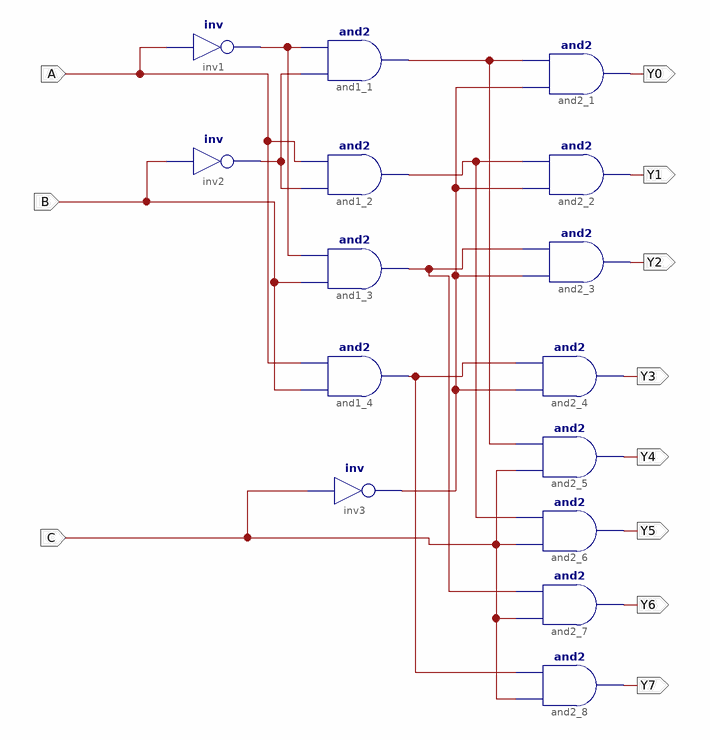
[diagram p0: schematic sheet 1]
// Xilinx ISE schematic decpder38_sch.sch (spartan3) as structural Verilog: 15 symbols, 11 ports
module decpder38_sch (
  input  A,
  input  B,
  input  C,
  output Y1,
  output Y2,
  output Y3,
  output Y4,
  output Y5,
  output Y6,
  output Y7,
  output Y0
);

  wire XLXN_4, XLXN_14, XLXN_16, XLXN_17, XLXN_22, XLXN_23, XLXN_33;

  and and1_1 (XLXN_33, XLXN_16, XLXN_14);
  and and1_2 (XLXN_22, XLXN_16, A);
  and and1_3 (XLXN_4, B, XLXN_14);
  and and1_4 (XLXN_23, B, A);
  and and2_1 (Y0, XLXN_17, XLXN_33);
  and and2_2 (Y1, XLXN_17, XLXN_22);
  and and2_3 (Y2, XLXN_17, XLXN_4);
  and and2_4 (Y3, XLXN_17, XLXN_23);
  and and2_5 (Y4, C, XLXN_33);
  and and2_6 (Y5, C, XLXN_22);
  and and2_7 (Y6, C, XLXN_4);
  and and2_8 (Y7, C, XLXN_23);
  not inv1 (XLXN_14, A);
  not inv2 (XLXN_16, B);
  not inv3 (XLXN_17, C);
endmodule
